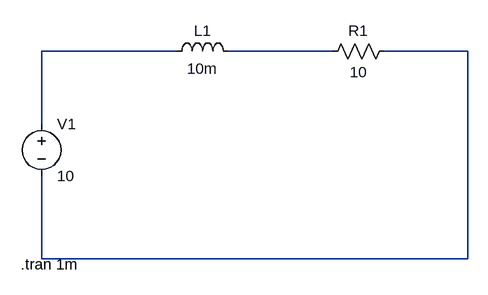
[diagram p0: schematic inductance.asc]
inductance.asc, the LTspice schematic file:
Version 4.1
SHEET 1 880 680
WIRE 176 -144 -32 -144
WIRE 416 -144 256 -144
WIRE 624 -144 496 -144
WIRE -32 -32 -32 -144
WIRE -32 176 -32 48
WIRE 624 176 624 -144
WIRE 624 176 -32 176
SYMBOL ind 160 -128 R270
WINDOW 0 32 56 VTop 2
WINDOW 3 5 56 VBottom 2
SYMATTR InstName L1
SYMATTR Value 10m
SYMBOL voltage -32 -48 R0
WINDOW 123 0 0 Left 0
WINDOW 39 0 0 Left 0
SYMATTR InstName V1
SYMATTR Value 10
SYMBOL res 512 -160 R90
WINDOW 0 0 56 VBottom 2
WINDOW 3 32 56 VTop 2
SYMATTR InstName R1
SYMATTR Value 10
TEXT -64 184 Left 2 !.tran 1m

The netlist it stands for:
* inductance.asc
L1 N001 N002 10m
V1 N001 N003 10
R1 N003 N002 10
.tran 1m
.backanno
.end